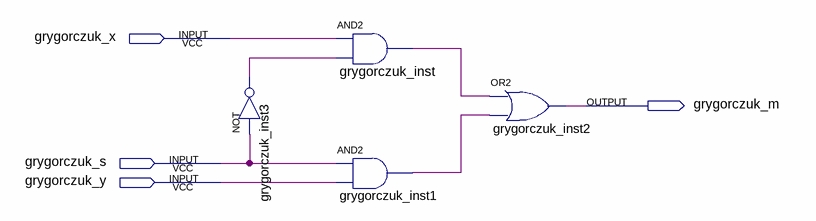
[diagram p0: schematic sheet]
// Quartus schematic MUX_2_1_Gates.bdf as structural Verilog: 4 symbols, 4 pins
module MUX_2_1_Gates (
  input  grygorczuk_x,
  input  grygorczuk_s,
  input  grygorczuk_y,
  output grygorczuk_m
);

  wire grygorczuk_inst1_out, grygorczuk_inst3_out, grygorczuk_inst_out;

  not grygorczuk_inst3 (grygorczuk_inst3_out, grygorczuk_s);
  and grygorczuk_inst (grygorczuk_inst_out, grygorczuk_x, grygorczuk_inst3_out);
  and grygorczuk_inst1 (grygorczuk_inst1_out, grygorczuk_s, grygorczuk_y);
  or grygorczuk_inst2 (grygorczuk_m, grygorczuk_inst_out, grygorczuk_inst1_out);
endmodule
